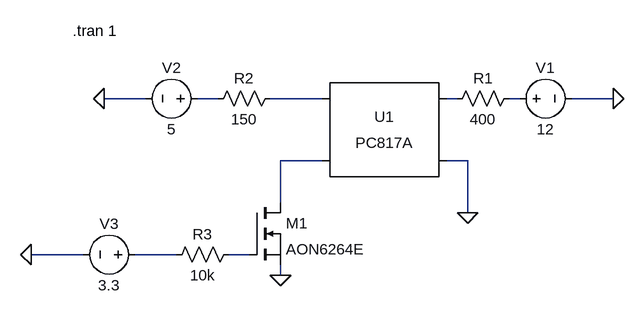
[diagram p0: schematic optocoupler.asc]
optocoupler.asc, the LTspice schematic file:
Version 4
SHEET 1 880 680
WIRE -160 112 -224 112
WIRE -48 112 -80 112
WIRE 112 112 32 112
WIRE 320 112 304 112
WIRE 416 112 400 112
WIRE 560 112 496 112
WIRE 112 208 48 208
WIRE 336 208 304 208
WIRE 48 272 48 208
WIRE 336 288 336 208
WIRE -256 352 -336 352
WIRE -112 352 -176 352
WIRE 0 352 -32 352
WIRE 48 384 48 368
FLAG 560 112 0
FLAG 336 288 0
FLAG -224 112 0
FLAG 48 384 0
FLAG -336 352 0
SYMBOL Optos\\PC817A 208 160 R0
SYMATTR InstName U1
SYMBOL voltage 400 112 R270
WINDOW 0 32 56 VTop 2
WINDOW 3 -32 56 VBottom 2
WINDOW 123 0 0 Left 0
WINDOW 39 0 0 Left 0
SYMATTR InstName V1
SYMATTR Value 12
SYMBOL res 416 96 R90
WINDOW 0 0 56 VBottom 2
WINDOW 3 32 56 VTop 2
SYMATTR InstName R1
SYMATTR Value 400
SYMBOL voltage -64 112 R90
WINDOW 0 -32 56 VBottom 2
WINDOW 3 32 56 VTop 2
WINDOW 123 0 0 Left 0
WINDOW 39 0 0 Left 0
SYMATTR InstName V2
SYMATTR Value 5
SYMBOL res 48 96 R90
WINDOW 0 0 56 VBottom 2
WINDOW 3 32 56 VTop 2
SYMATTR InstName R2
SYMATTR Value 150
SYMBOL nmos 0 272 R0
SYMATTR InstName M1
SYMATTR Value AON6264E
SYMBOL res -16 336 R90
WINDOW 0 0 56 VBottom 2
WINDOW 3 32 56 VTop 2
SYMATTR InstName R3
SYMATTR Value 10k
SYMBOL voltage -160 352 R90
WINDOW 0 -32 56 VBottom 2
WINDOW 3 32 56 VTop 2
WINDOW 123 0 0 Left 0
WINDOW 39 0 0 Left 0
SYMATTR InstName V3
SYMATTR Value 3.3
TEXT -272 8 Left 2 !.tran 1

The netlist it stands for:
* optocoupler.asc
XU1 N002 N005 N003 0 PC817 Igain=1m
V1 N004 0 12
R1 N004 N003 400
V2 N001 0 5
R2 N002 N001 150
M1 N005 N007 0 0 AON6264E
R3 N007 N006 10k
V3 N006 0 3.3
.model NMOS NMOS
.model PMOS PMOS
.lib standard.mos
.tran 1
.lib PC817.sub
.backanno
.end